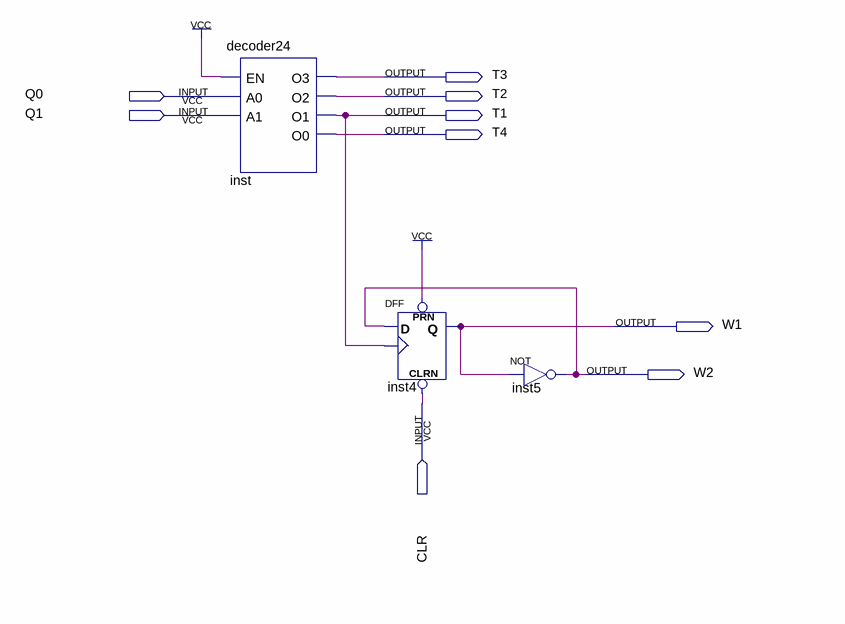
[diagram p0: schematic sheet]
// Quartus schematic Timing.bdf as structural Verilog: 3 symbols, 9 pins
module Timing (
  input  Q0,
  input  Q1,
  input  CLR,
  output T3,
  output T2,
  output T1,
  output T4,
  output W1,
  output W2
);

  decoder24 inst (.EN(1'b1), .A0(Q0), .A1(Q1), .O3(T3), .O2(T2), .O1(T1), .O0(T4));
  DFF inst4 (.CLRN(CLR), .CLK(T1), .D(W2), .PRN(1'b1), .Q(W1));
  not inst5 (W2, W1);
endmodule
